# Altium schematic sheet PDM.SchDoc: =DocumentName
size A4; Organization: Queen's Formula SAE; Address1: 130 Stuart St, Kingston; Address2: Ontario; Address3: Canada; Address4: K7L 2V9; DocumentNumber: 1; Revision: 0; SheetNumber: 1; SheetTotal: 1
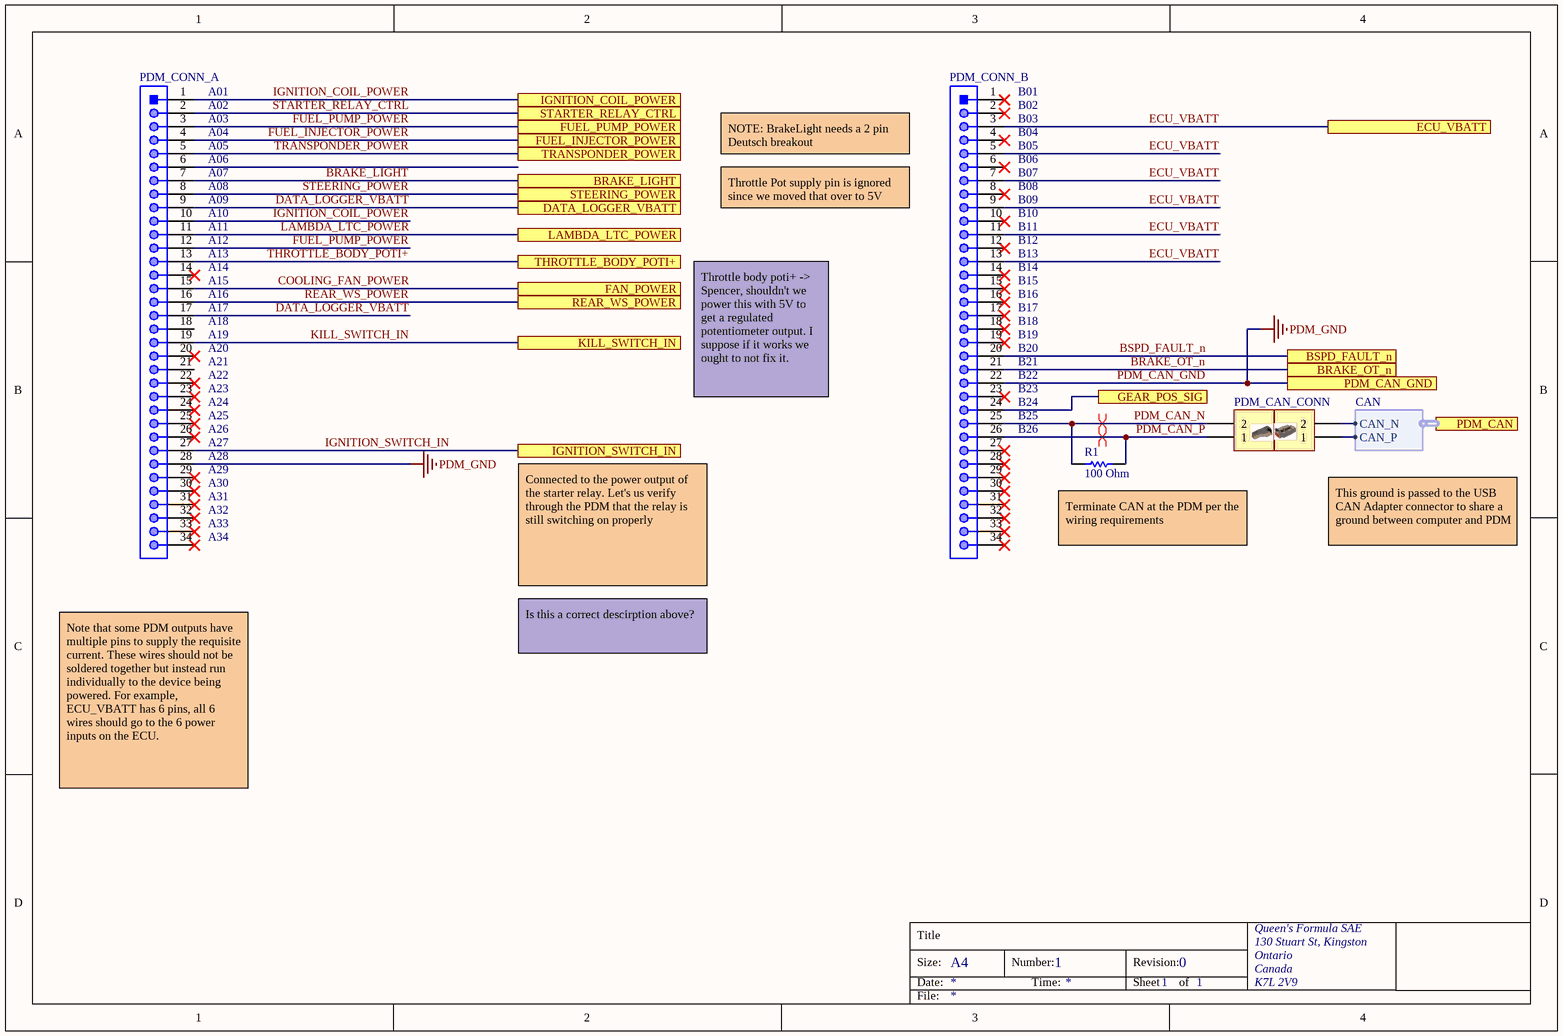
[diagram p0: PDM.SchDoc]

## Parts
(Parts that share a designator on the sheet are numbered #1, #2 ... from top to bottom, then left to right.)
PDM_CAN_CONN#1  Header 2  [HDR1X2]  (value not drawn)
PDM_CAN_CONN#2  Header 2  [HDR1X2]  (value not drawn)
PDM_CONN_A  61303411021  [61303411021]  (value not drawn)
PDM_CONN_B  61303411021  [61303411021]  (value not drawn)
R1  100 Ohm  [RESC3216X70X50NL05T20]

## Ports
BRAKE_LIGHT, BRAKE_OT_n, BSPD_FAULT_n, DATA_LOGGER_VBATT, ECU_VBATT, FAN_POWER, FUEL_INJECTOR_POWER, FUEL_PUMP_POWER, GEAR_POS_SIG, IGNITION_COIL_POWER, IGNITION_SWITCH_IN, KILL_SWITCH_IN, LAMBDA_LTC_POWER, PDM_CAN (harness CAN), PDM_CAN_GND, REAR_WS_POWER, STARTER_RELAY_CTRL, STEERING_POWER, THROTTLE_BODY_POTI+, TRANSPONDER_POWER

## Harnesses
CAN: CAN_P, CAN_N

## Nets
PDM_CAN_GND: PDM_CONN_A.28 PDM_CONN_B.22 ; port PDM_CAN_GND  [also labelled PDM_GND]
BRAKE_LIGHT: PDM_CONN_A.7 ; port BRAKE_LIGHT
BRAKE_OT_n: PDM_CONN_B.21 ; port BRAKE_OT_n
BSPD_FAULT_n: PDM_CONN_B.20 ; port BSPD_FAULT_n
COOLING_FAN_POWER: PDM_CONN_A.15 ; port FAN_POWER
DATA_LOGGER_VBATT: PDM_CONN_A.9 PDM_CONN_A.17 ; port DATA_LOGGER_VBATT
ECU_VBATT: PDM_CONN_B.3 PDM_CONN_B.5 PDM_CONN_B.7 PDM_CONN_B.9 PDM_CONN_B.11 PDM_CONN_B.13 ; port ECU_VBATT
FUEL_INJECTOR_POWER: PDM_CONN_A.4 ; port FUEL_INJECTOR_POWER
FUEL_PUMP_POWER: PDM_CONN_A.3 PDM_CONN_A.12 ; port FUEL_PUMP_POWER
GEAR_POS_SIG: PDM_CONN_B.24 ; port GEAR_POS_SIG
IGNITION_COIL_POWER: PDM_CONN_A.1 PDM_CONN_A.10 ; port IGNITION_COIL_POWER
IGNITION_SWITCH_IN: PDM_CONN_A.27 ; port IGNITION_SWITCH_IN
KILL_SWITCH_IN: PDM_CONN_A.19 ; port KILL_SWITCH_IN
LAMBDA_LTC_POWER: PDM_CONN_A.11 ; port LAMBDA_LTC_POWER
PDM_CAN_N: PDM_CAN_CONN#1.2 PDM_CONN_B.25 R1.1
PDM_CAN_P: PDM_CAN_CONN#1.1 PDM_CONN_B.26 R1.2
REAR_WS_POWER: PDM_CONN_A.16 ; port REAR_WS_POWER
STARTER_RELAY_CTRL: PDM_CONN_A.2 ; port STARTER_RELAY_CTRL
STEERING_POWER: PDM_CONN_A.8 ; port STEERING_POWER
THROTTLE_BODY_POTI+: PDM_CONN_A.13 ; port THROTTLE_BODY_POTI+
TRANSPONDER_POWER: PDM_CONN_A.5 ; port TRANSPONDER_POWER
NetPDM_CAN_CONN#2_1: PDM_CAN_CONN#2.1 ; port PDM_CAN.CAN_P
NetPDM_CAN_CONN#2_2: PDM_CAN_CONN#2.2 ; port PDM_CAN.CAN_N

Not connected (* = marked no-connect by the designer): PDM_CONN_A 6 14* 18 20* 21 22* 23* 24* 25* 26* 29* 30* 31* 32* 33* 34*; PDM_CONN_B 1* 2* 4* 6* 8* 10* 12* 14* 15* 16* 17* 18* 19* 23* 27* 28* 29* 30* 31* 32* 33* 34*

## Layout directives
differential pair: PDM_CAN_N, PDM_CAN_P

## Notes on the sheet
- (near PDM_CONN_A) A01
- (near PDM_CONN_A) A02
- (near PDM_CONN_B) B01
- (near PDM_CONN_B) B02
- (near PDM_CONN_A) A03
- (near PDM_CONN_A) A04
- (near PDM_CONN_A) A05
- (near PDM_CONN_A) A06
- (near PDM_CONN_A) A07
- NOTE: BrakeLight needs a 2 pin Deutsch breakout
- (near PDM_CONN_B) B03
- (near PDM_CONN_B) B04
- (near PDM_CONN_B) B05
- (near PDM_CONN_B) B06
- (near PDM_CONN_B) B07
- (near PDM_CONN_A) A08
- (near PDM_CONN_A) A09
- (near PDM_CONN_A) A10
- (near PDM_CONN_A) A11
- (near PDM_CONN_A) A12
- Throttle Pot supply pin is ignored since we moved that over to 5V
- (near PDM_CONN_B) B08
- (near PDM_CONN_B) B09
- (near PDM_CONN_B) B10
- (near PDM_CONN_B) B11
- (near PDM_CONN_B) B12
- (near PDM_CONN_A) A13
- (near PDM_CONN_A) A14
- (near PDM_CONN_A) A15
- (near PDM_CONN_A) A16
- (near PDM_CONN_A) A17
- (near PDM_CONN_B) B13
- (near PDM_CONN_B) B14
- (near PDM_CONN_B) B15
- (near PDM_CONN_B) B16
- (near PDM_CONN_B) B17
- (near PDM_CONN_A) A18
- (near PDM_CONN_A) A19
- (near PDM_CONN_A) A20
- (near PDM_CONN_A) A21
- (near PDM_CONN_A) A22
- (near PDM_CONN_B) B18
- (near PDM_CONN_B) B19
- (near PDM_CONN_B) B20
- (near PDM_CONN_B) B21
- (near PDM_CONN_B) B22
- (near PDM_CONN_A) A23
- (near PDM_CONN_A) A24
- (near PDM_CONN_A) A25
- (near PDM_CONN_A) A26
- (near PDM_CONN_A) A27
- Throttle body poti+ -> Spencer, shouldn't we power this with 5V to get a regulated potentiometer output. I suppose if it works we ought to not fix it.
- (near PDM_CONN_B) B23
- (near PDM_CONN_B) B24
- B25
- B26
- (near PDM_CONN_A) A28
- (near PDM_CONN_A) A29
- (near PDM_CONN_A) A30
- (near PDM_CONN_A) A31
- (near PDM_CONN_A) A32
- (near PDM_CONN_A) A33
- (near PDM_CONN_A) A34
- Connected to the power output of the starter relay. Let's us verify through the PDM that the relay is still switching on properly
- (near R1) Terminate CAN at the PDM per the wiring requirements
- (near PDM_CAN_CONN#2) This ground is passed to the USB CAN Adapter connector to share a ground between computer and PDM
- Is this a correct descirption above?
- Note that some PDM outputs have multiple pins to supply the requisite current. These wires should not be soldered together but instead run individually to the device being powered. For example, ECU_VBATT has 6 pins, all 6 wires should go to the 6 power inputs on the ECU.
- Title
- Size:
- Date:
- A4
- Number:
- Time:
- Revision:
- Sheet
- of
- File:

## Library data of the parts
PDM_CAN_CONN#1 PDM_CAN_CONN#2 = Header 2: Header, 2-Pin; LatestRevisionDate: 17-Jul-2002; LatestRevisionNote: Re-released for DXP Platform.; Publisher: Altium Limited
PDM_CONN_A PDM_CONN_B = CMP-1502-01125-1: THT Angled Pin Header WR-PHD, Pitch 2.54 mm, Single Row, 34 pins; Manufacturer: Wurth Elektronik; Withstanding Voltage: 500VAC; Pin Number: 34; Rated Current: 3A; Gender: Male; Pitch: 2.54mm; Working Voltage: 250VAC; Contact Resistance: 20mOhm; Orientation: Angled; Mounting Technology: THT; Package Reference: 61303411021; Part Number: 61303411021; Datasheet URL: https://katalog.we-online.de/em/datasheet/6130xx11021.pdf; Publisher: WurthElektronik; Row Number: Single; Operating Temperature: -40to105degC; Packaging: Bag; Manufacturer URL: http://www.we-online.de
R1 = CMP-2003-00016-1: Manufacturer: Panasonic; Part Number: ERJ-8ENF1000V